# Altium project Agrobot_1.1.PrjPcb
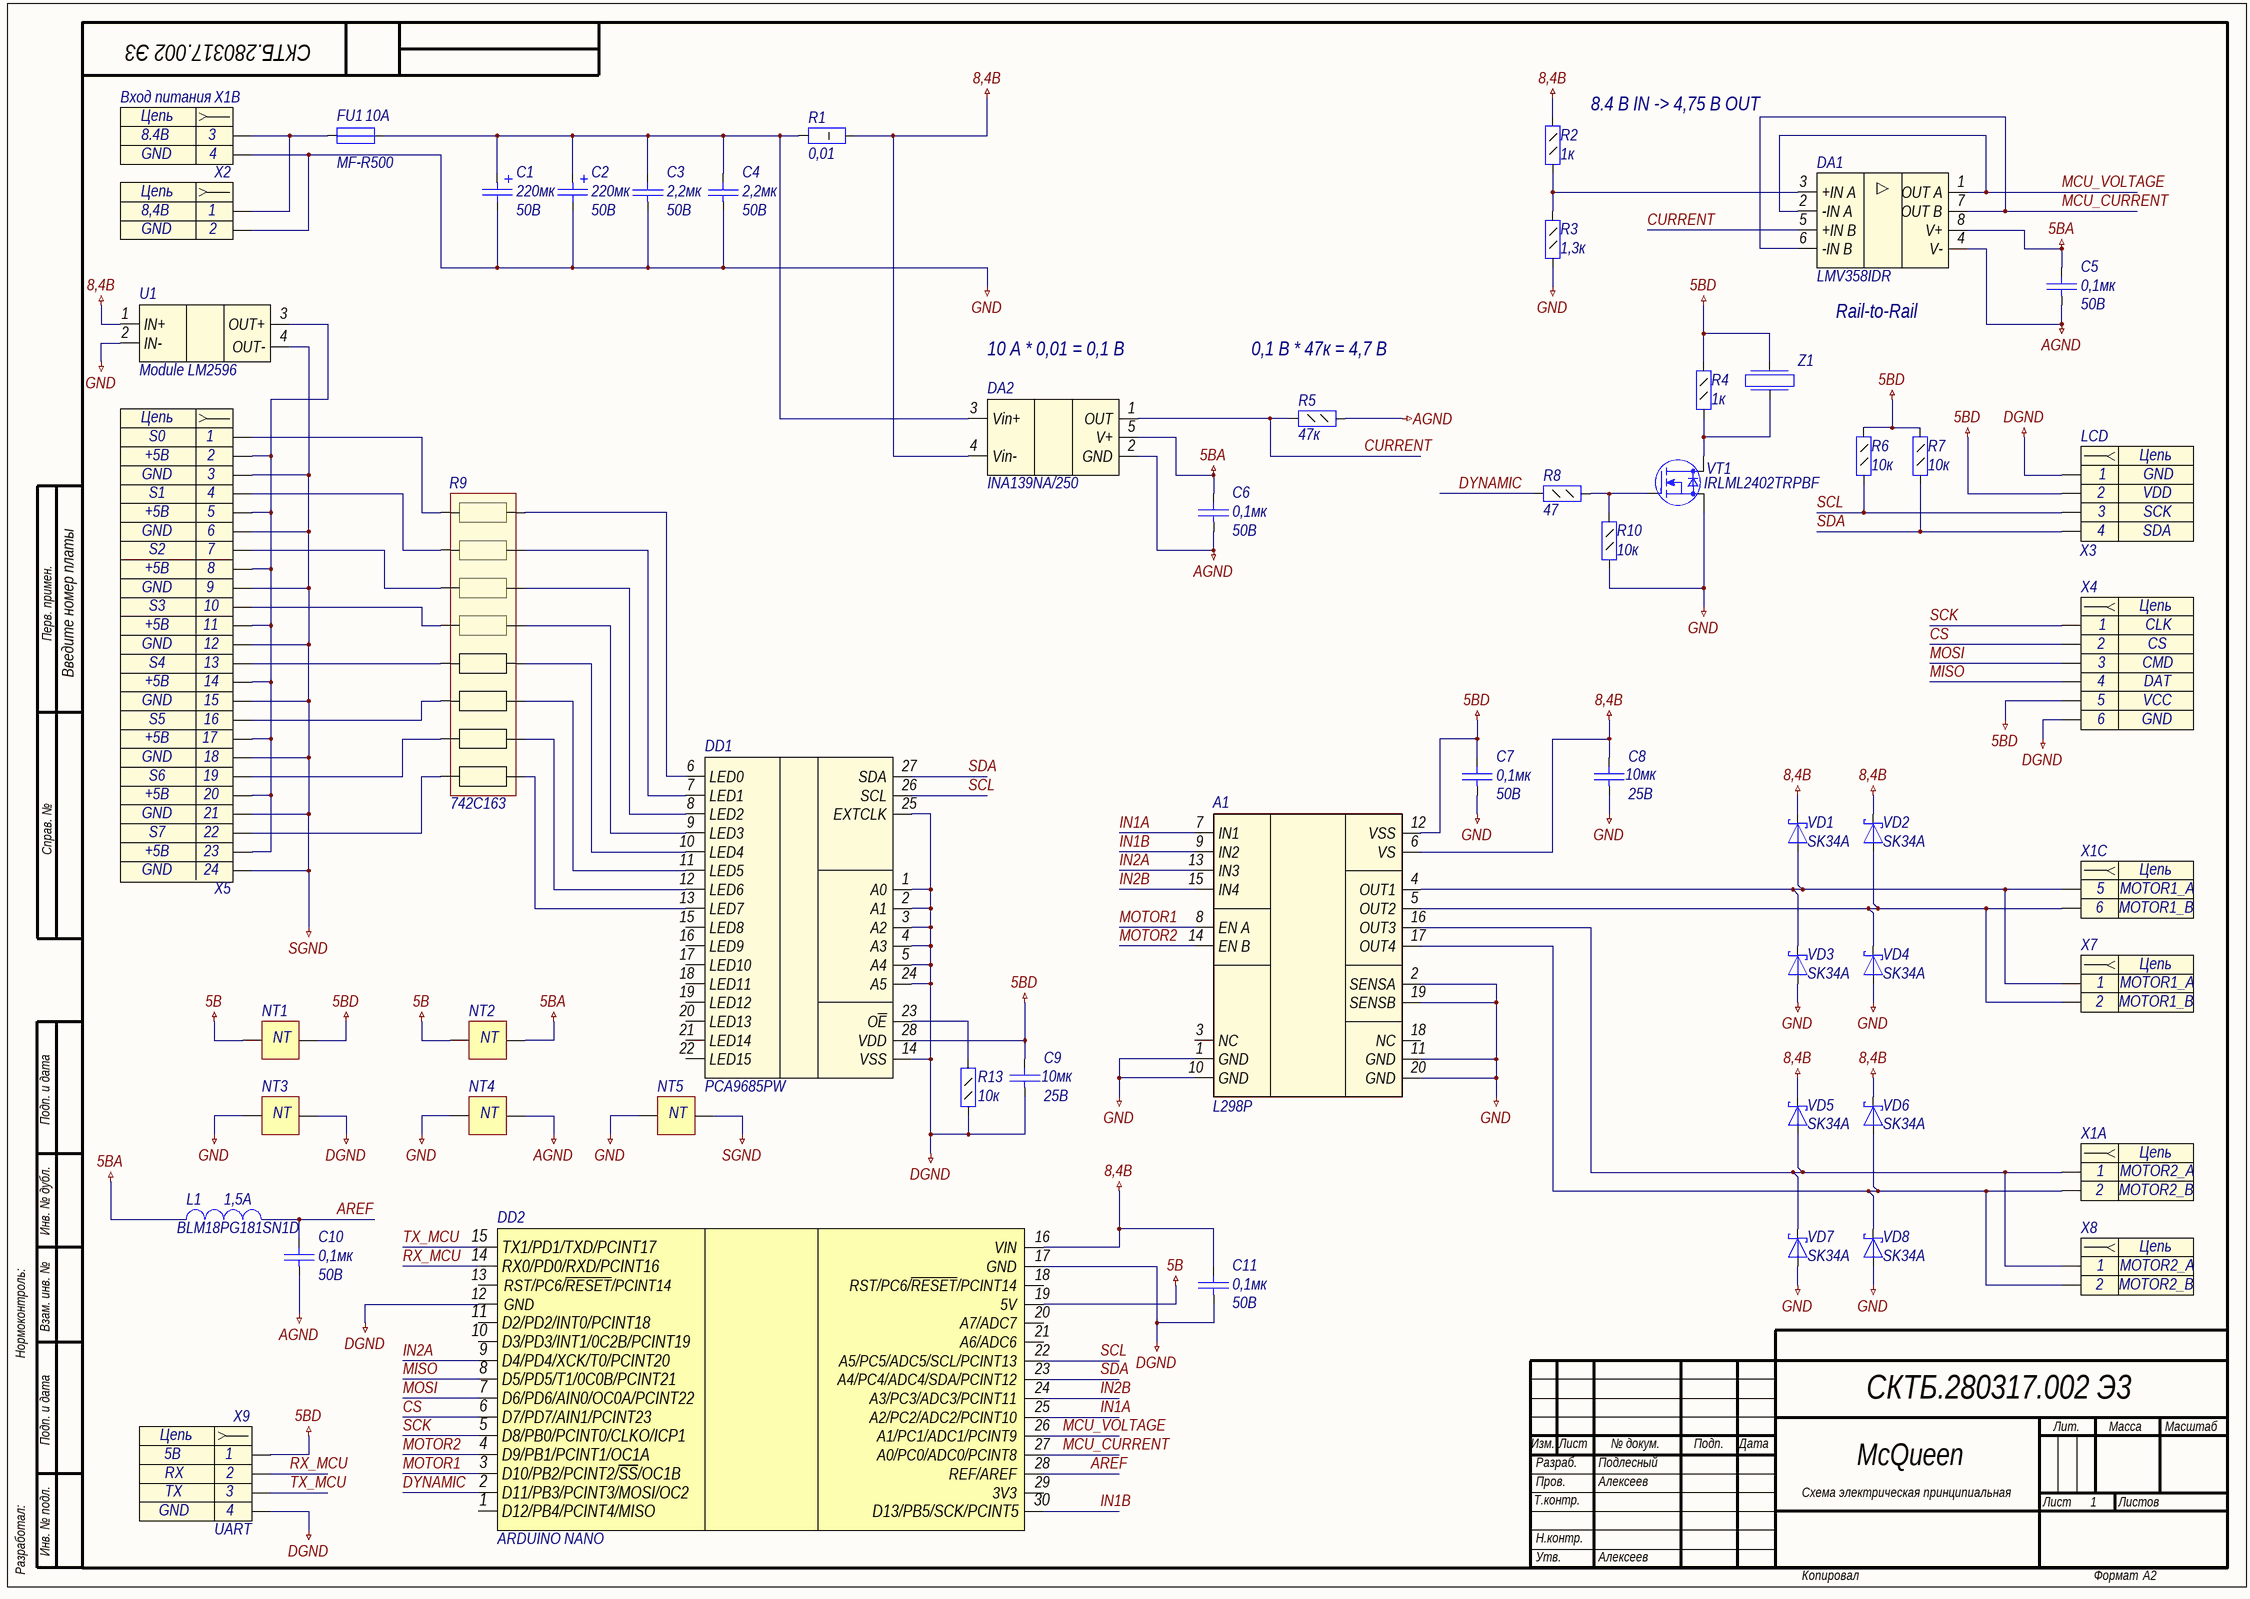
[diagram p0: Agrobot_1.1.SchDoc]
1 sheet, 53 parts. Net scope: global (net labels, ports and power ports of the same name join across sheets).
Board file: Agrobot_1.1.PcbDoc

## Sheet Agrobot_1.1.SchDoc: Kapitoshka
size 594 x 420 mm; ApprovedBy: Алексеев; CheckedBy: Алексеев; DrawnBy: Подлесный; DocumentNumber: СКТБ.280317.002 Э3; SheetNumber: 1; Format: A2; DocumentType: Схема электрическая принципиальная; ImagePath: Введите номер платы

### Parts
A1  L298P  [POWERSO20]
C1  value 220мк  Voltage: 50В  [Cap_SMD_radial_polar(10x10.5)]  (hidden comment: Capacitor_pol)
C2  value 220мк  Voltage: 50В  [Cap_SMD_radial_polar(10x10.5)]  (hidden comment: Capacitor_pol)
C3  value 2,2мк  Voltage: 50B  [C0805]  (hidden comment: Capacitor)
C4  value 2,2мк  Voltage: 50B  [C0805]  (hidden comment: Capacitor)
C5  value 0,1мк  Voltage: 50B  [C0805]  (hidden comment: Capacitor)
C6  value 0,1мк  Voltage: 50B  [C0805]  (hidden comment: Capacitor)
C7  value 0,1мк  Voltage: 50B  [C0805]  (hidden comment: Capacitor)
C8  value 10мк  Voltage: 25В  [C1210]  (hidden comment: Capacitor)
C9  value 10мк  Voltage: 25В  [C1210]  (hidden comment: Capacitor)
C10  value 0,1мк  Voltage: 50B  [C0805]  (hidden comment: Capacitor)
C11  value 0,1мк  Voltage: 50B  [C0805]  (hidden comment: Capacitor)
DA1  LMV358IDR  [SO8]
DA2  INA139NA/250  [SOT23-5]
DD1  PCA9685PW  [TSSOP28]
DD2  ARDUINO NANO  [ARDUINO NANO]
FU1  I trip: 10A  [MF-R500]  (hidden comment: Fuse)
L1  Part Number: BLM18PG181SN1D  Rated Current: 1,5A  [L0603]  (hidden comment: Inductor)
NT1  Pofigistor  [Pofigistor0603]  (value not drawn)  (net tie, no BOM)
NT2  Pofigistor  [Pofigistor0603]  (value not drawn)  (net tie, no BOM)
NT3  Pofigistor  [Pofigistor0603]  (value not drawn)  (net tie, no BOM)
NT4  Pofigistor  [Pofigistor0603]  (value not drawn)  (net tie, no BOM)
NT5  Pofigistor  [Pofigistor0603]  (value not drawn)  (net tie, no BOM)
R1  value 0,01  [R2512]  (hidden comment: Resistor_1Вт)
R2  value 1к  [R0805]  (hidden comment: Resistor_0,125Вт)
R3  value 1,3к  [R0805]  (hidden comment: Resistor_0,125Вт)
R4  value 1к  [R0805]  (hidden comment: Resistor_0,125Вт)
R5  value 47к  [R0805]  (hidden comment: Resistor_0,125Вт)
R6  value 10к  [R0805]  (hidden comment: Resistor_0,125Вт)
R7  value 10к  [R0805]  (hidden comment: Resistor_0,125Вт)
R8  value 47  [R0805]  (hidden comment: Resistor_0,125Вт)
R9  742C163  [8xR1206]
R10  value 10к  [R0805]  (hidden comment: Resistor_0,125Вт)
R13  value 10к  [R0805]  (hidden comment: Resistor_0,125Вт)
U1  Module LM2596  [module LM2596]
VD1  Part Number: SK34A  [SMA]  (hidden comment: DiodeSchottky)
VD2  Part Number: SK34A  [SMA]  (hidden comment: DiodeSchottky)
VD3  Part Number: SK34A  [SMA]  (hidden comment: DiodeSchottky)
VD4  Part Number: SK34A  [SMA]  (hidden comment: DiodeSchottky)
VD5  Part Number: SK34A  [SMA]  (hidden comment: DiodeSchottky)
VD6  Part Number: SK34A  [SMA]  (hidden comment: DiodeSchottky)
VD7  Part Number: SK34A  [SMA]  (hidden comment: DiodeSchottky)
VD8  Part Number: SK34A  [SMA]  (hidden comment: DiodeSchottky)
VT1  Part Number: IRLML2402TRPBF  [SOT23-3]  (hidden comment: N-MOSFET)
X1  (no value)  [DT-128V-6]  (parts A,B,C of 3)
X2  Header_2_sct  [2HOLE_2.5]  (value not drawn)
X3  LCD  [PLS-4HOLES]
X4  Header_6_sct  [PSP_ANTENNA]  (value not drawn)
X5  Header_24_sct  [PLS-24-3]  (value not drawn)
X7  Header_2_sct  [2HOLE_2.5]  (value not drawn)
X8  Header_2_sct  [2HOLE_2.5]  (value not drawn)
X9  UART  [PLS-4HOLES]
Z1  (no value)  [Buzzer_9mm]

### Nets
5В: DD2.19(5V) NT1.1 NT2.1
5ВA: C5.2 C6.2 DA1.8(V+) DA2.5(V+) L1.1 NT2.2
5ВD: A1.12(VSS) C7.2 C9.2 DD1.28(VDD) NT1.2 R4.1 R6.1 R7.1 X3.2 X4.5 X9.1 Z1.2
8,4В: A1.6(VS) C8.2 C11.2 DA2.4(Vin-) DD2.16(VIN) R1.2 R2.1 U1.1(IN+) VD1.1(K) VD2.1(K) VD5.1(K) VD6.1(K)
AGND: C5.1 C6.1 C10.1 DA1.4(V-) DA2.2(GND) NT4.2 R5.1
DGND: C9.1 C11.1 DD1.1(A0) DD1.2(A1) DD1.3(A2) DD1.4(A3) DD1.5(A4) DD1.14(VSS) DD1.24(A5) DD1.25(EXTCLK) DD2.12(GND) DD2.17(GND) NT3.2 R13.1 X3.1 X4.6 X9.4
GND: A1.1(GND) A1.2(SENSA) A1.10(GND) A1.11(GND) A1.19(SENSB) A1.20(GND) C1.2 C2.2 C3.1 C4.1 C7.1 C8.1 NT3.1 NT4.1 NT5.1 R3.2 R10.2 U1.2(IN-) VD3.2(A) VD4.2(A) VD7.2(A) VD8.2(A) VT1.2(S) X1.4 X2.2
SGND: NT5.2 U1.4(OUT-) X5.3 X5.6 X5.9 X5.12 X5.15 X5.18 X5.21 X5.24
AREF: C10.2 DD2.28(REF/AREF) L1.2
CS: DD2.6(D7/PD7/AIN1/PCINT23) X4.2
CURRENT: DA1.5(+IN_B) DA2.1(OUT) R5.2
DYNAMIC: DD2.2(D11/PB3/PCINT3/MOSI/OC2) R8.2
IN1A: A1.7(IN1) DD2.25(A2/PC2/ADC2/PCINT10)
IN1B: A1.9(IN2) DD2.30(D13/PB5/SCK/PCINT5)
IN2A: A1.13(IN3) DD2.9(D4/PD4/XCK/T0/PCINT20)
IN2B: A1.15(IN4) DD2.24(A3/PC3/ADC3/PCINT11)
MCU_CURRENT: DA1.6(-IN_B) DA1.7(OUT_B) DD2.27(A0/PC0/ADC0/PCINT8)
MCU_VOLTAGE: DA1.1(OUT_A) DA1.2(-IN_A) DD2.26(A1/PC1/ADC1/PCINT9)
MISO: DD2.8(D5/PD5/T1/0C0B/PCINT21) X4.4
MOSI: DD2.7(D6/PD6/AIN0/OC0A/PCINT22) X4.3
MOTOR1: A1.8(EN_A) DD2.3(D10/PB2/PCINT2/~{SS}/OC1B)
MOTOR2: A1.14(EN_B) DD2.4(D9/PB1/PCINT1/OC1A)
RX_MCU: DD2.14(RX0/PD0/RXD/PCINT16) X9.2
SCK: DD2.5(D8/PB0/PCINT0/CLKO/ICP1) X4.1
SCL: DD1.26(SCL) DD2.22(A5/PC5/ADC5/SCL/PCINT13) R6.2 X3.3
SDA: DD1.27(SDA) DD2.23(A4/PC4/ADC4/SDA/PCINT12) R7.2 X3.4
TX_MCU: DD2.15(TX1/PD1/TXD/PCINT17) X9.3
NetA1_4: A1.4(OUT1) VD1.2(A) VD3.1(K) X1.5 X7.1
NetA1_5: A1.5(OUT2) VD2.2(A) VD4.1(K) X1.6 X7.2
NetA1_16: A1.16(OUT3) VD5.2(A) VD7.1(K) X1.1 X8.1
NetA1_17: A1.17(OUT4) VD6.2(A) VD8.1(K) X1.2 X8.2
NetC1_1: C1.1 C2.1 C3.2 C4.2 DA2.3(Vin+) FU1.2 R1.1
NetDA1_3: DA1.3(+IN_A) R2.2 R3.1
NetDD1_6: DD1.6(LED0) R9.2
NetDD1_7: DD1.7(LED1) R9.4
NetDD1_8: DD1.8(LED2) R9.6
NetDD1_9: DD1.9(LED3) R9.8
NetDD1_10: DD1.10(LED4) R9.10
NetDD1_11: DD1.11(LED5) R9.12
NetDD1_12: DD1.12(LED6) R9.14
NetDD1_13: DD1.13(LED7) R9.16
NetDD1_23: DD1.23(O~{E}) R13.2
NetFU1_1: FU1.1 X1.3 X2.1
NetR4_2: R4.2 VT1.3(D) Z1.1
NetR8_1: R8.1 R10.1 VT1.1(G)
NetR9_1: R9.1 X5.1
NetR9_3: R9.3 X5.4
NetR9_5: R9.5 X5.7
NetR9_7: R9.7 X5.10
NetR9_9: R9.9 X5.13
NetR9_11: R9.11 X5.16
NetR9_13: R9.13 X5.19
NetR9_15: R9.15 X5.22
NetU1_3: U1.3(OUT+) X5.2 X5.5 X5.8 X5.11 X5.14 X5.17 X5.20 X5.23

Not connected (* = marked no-connect by the designer): A1 3(NC) 18(NC); DD1 15(LED8) 16(LED9) 17(LED10) 18(LED11) 19(LED12) 20(LED13) 21(LED14) 22(LED15); DD2 1(D12/PB4/PCINT4/MISO) 10(D3/PD3/INT1/0C2B/PCINT19) 11(D2/PD2/INT0/PCINT18) 13(RST/PC6/~{RESET}/PCINT14) 18(RST/PC6/~{RESET}/PCINT14) 20(A7/ADC7) 21(A6/ADC6) 29(3V3)

### Notes on the sheet
- 8.4 B IN -> 4,75 B OUT
- 10 А * 0,01 = 0,1 В
- 0,1 В * 47к = 4,7 В
- Rail-to-Rail
- Перв. примен.
- Справ. №
- Подп. и дата
- Инв. № дубл.
- Нормоконтроль:
- Взам. инв. №
- Изм.
- Лист
- № докум.
- Подп.
- Дата
- Лит.
- Масса
- Масштаб
- Т.контр.
- Пров.
- Разраб.
- McQueen
- Листов
- Разработал:
- Инв. № подл.
- Н.контр.
- Утв.
- Копировал
- Формат
- (in symbol connect9) Цепь
- (in symbol connect10) Цепь
- (in symbol connect10, part A) Цепь
- (in symbol connect10, part B) Цепь
- (in symbol connect10, part C) Цепь
- (in symbol connect11) Цепь
- (in symbol connect13) Цепь
- (in symbol res1930) NT

### Library data of the parts
A1 = driver1: FULL BRIDGE DC MOTOR DRIVER; Logic Voltage: 4,5-5-7B; Max Operating Supply Voltage: 46B; Maximum Power Dissipation: 25W; id: driver1; Part Name: Motor Driver
C1 C2 = cap195: Конденсатор полярный; Part Name: Capacitors_pol; Part Number: ECAP SMD; id: cap195
C3-C7 C10 C11 = cap153: Конденсатор; Part Number: GRM21BR71E225K; Part Name: Capacitors; id: cap153; TKE: X7R
C8 C9 = cap194: Конденсатор; Part Name: Capacitors; Part Number: GRM32ER61A106K; id: cap194; TKE: X7R
DA1 = amp2: LOW-VOLTAGE RAIL-TO-RAIL OUTPUT OPERATIONAL AMPLIFIERS; id: amp2; Bandwidth: 1МГц; Rail-to-rail: yes; Supply Voltage: 2,7-5B; CMRR: 63dB; Ksvr: 60dB; Offset voltage: 1,7mB; Channels: 2; Part Name: OPERATIONAL AMPLIFIERS; Part Number: LMV358IDR
DA2 = amp3: Измерительный датчик тока; Part Name: Measurement Current Shunt Monitor; id: amp3; Supply Voltage: 2,7-5-40B; CMRR: 115dB; Offset voltage: 0,2mB; Channels: 1; Part Number: INA139NA/250
DD1 = driver0: Драйвер светодиода, 16 выходов; Part Name: LED Driver; Operating Supply Voltage: 3,3B; Min Operating Supply Voltage: 2,3B; Max Operating Supply Voltage: 5,5B; Max Supply Current: 10000uA; Maximum Power Dissipation: 400mW; id: driver0
DD2 = ARDUINO NANO: Отладочная плата ATmega328; Part Name: DevBoard; id: microcont4; Part Number: ARDUINO NANO
FU1 = fuse1: Предохранитель; Part Name: Resettable Fuses; Manufacture: Bourns; id: fuse1; I hold: 5A; Resistance: 0,02; Part Number: MF-R500
L1 = BLM18PG181SN1D: EMI Suppression Filter; Part Name: EMI Suppression Filters; id: ind0; Resistance: 0,09Ohm
NT1-NT5 = res1930: Value: 0; id: res1930; Part Name: Pofigistor
R1 = res1550: Резистор; Accuracy: 1%; Power: 1Вт; id: res1550; Part Name: Resistor
R2-R8 R10 R13 = 0: Резистор; id: res0; Accuracy: 1%; Part Name: Resistor; Power: 0,125Вт
R9 = 742C163: Резисторная сборка; Name: *; Value: 742C163
U1 = module0: Low-Dropout Regulator for 5-V to 3.3-V Conversion; id: module0; Part Name: LM2596
VD1-VD8 = SK34A: Диод Шоттки; id: diode2; Backward Voltage: 40B; Forward Voltage: 0,55B; Forward Current: 3A; Part Name: Diode Schottky
VT1 = IRLML2402TRPBF: Part Name: Transistor; id: trans2; Structure: n-channel; V drain-source max: 20B; Rds: 0,25Ohm; Gate-to-source voltage: (+-)12B; Continuous drain current: 1,2A; Pulsed drain current: 7,4A; Power dissipation: 0,54W
X1 = connect10: POWER; Part Name: TERMINAL BLOCK; Contact_2: MOTOR2_B; Contact_1: MOTOR2_A; Contact_5: Contact_5; Contact_6: Contact_6; Contact_4: Contact_4; Contact_3: Contact_3; id: connect10
X2 = connect10: Разъем - 2 конт. розетка; Part Name: Hole for connector; Contact_1: 8,4B; Contact_2: GND; id: connect10
X3 = connect11: Разъем - 4 конт. розетка; Part Name: Hole for connector; Contact_1: GND; Contact_2: VDD; Contact_3: SCK; Contact_4: SDA; id: connect11
X4 = connect13: Разъем - 6 конт. розетка; Part Name: PSP Antenna Joystick; Contact_1: CLK; Contact_2: CS; Contact_3: CMD; Contact_4: DAT; Contact_5: VCC; Contact_6: GND; id: connect13
X5 = connect9: Разъем - 5 конт. розетка; Part Name: PLS-24 3way; Contact_1: S0; Contact_2: +5B; Contact_3: GND; Contact_4: S1; Contact_7: S2; Contact_10: S3; Contact_13: S4; Contact_16: S5; Contact_19: S6; Contact_22: S7; Contact_5: +5B; Contact_6: GND; id: connect9; Contact_8: +5B; Contact_9: GND; Contact_11: +5B; Contact_12: GND; Contact_14: +5B; Contact_15: GND; Contact_17: +5B; Contact_18: GND; Contact_20: +5B; Contact_21: GND; Contact_23: +5B; Contact_24: GND
X7 = connect10: Разъем - 2 конт. розетка; Part Name: Hole for connector; Contact_1: MOTOR1_A; Contact_2: MOTOR1_B; id: connect10
X8 = connect10: Разъем - 2 конт. розетка; Part Name: Hole for connector; Contact_1: MOTOR2_A; Contact_2: MOTOR2_B; id: connect10
X9 = connect11: Разъем - 4 конт. розетка; Part Name: Hole for connector; Contact_1: 5B; Contact_2: RX; Contact_3: TX; Contact_4: GND; id: connect11
Z1 = HC0905F: Пьезоизлучатель звуковой без генератора; id: buzzer0; Frequence: 3200Hz; Generator: no; Intensity: 85dB; Resistance: 40Ohm; Supply Voltage: 5B; Max  Current: 80mA; Part Number: HC0905F